# Altium project RF_AMPL_002.PrjPcb
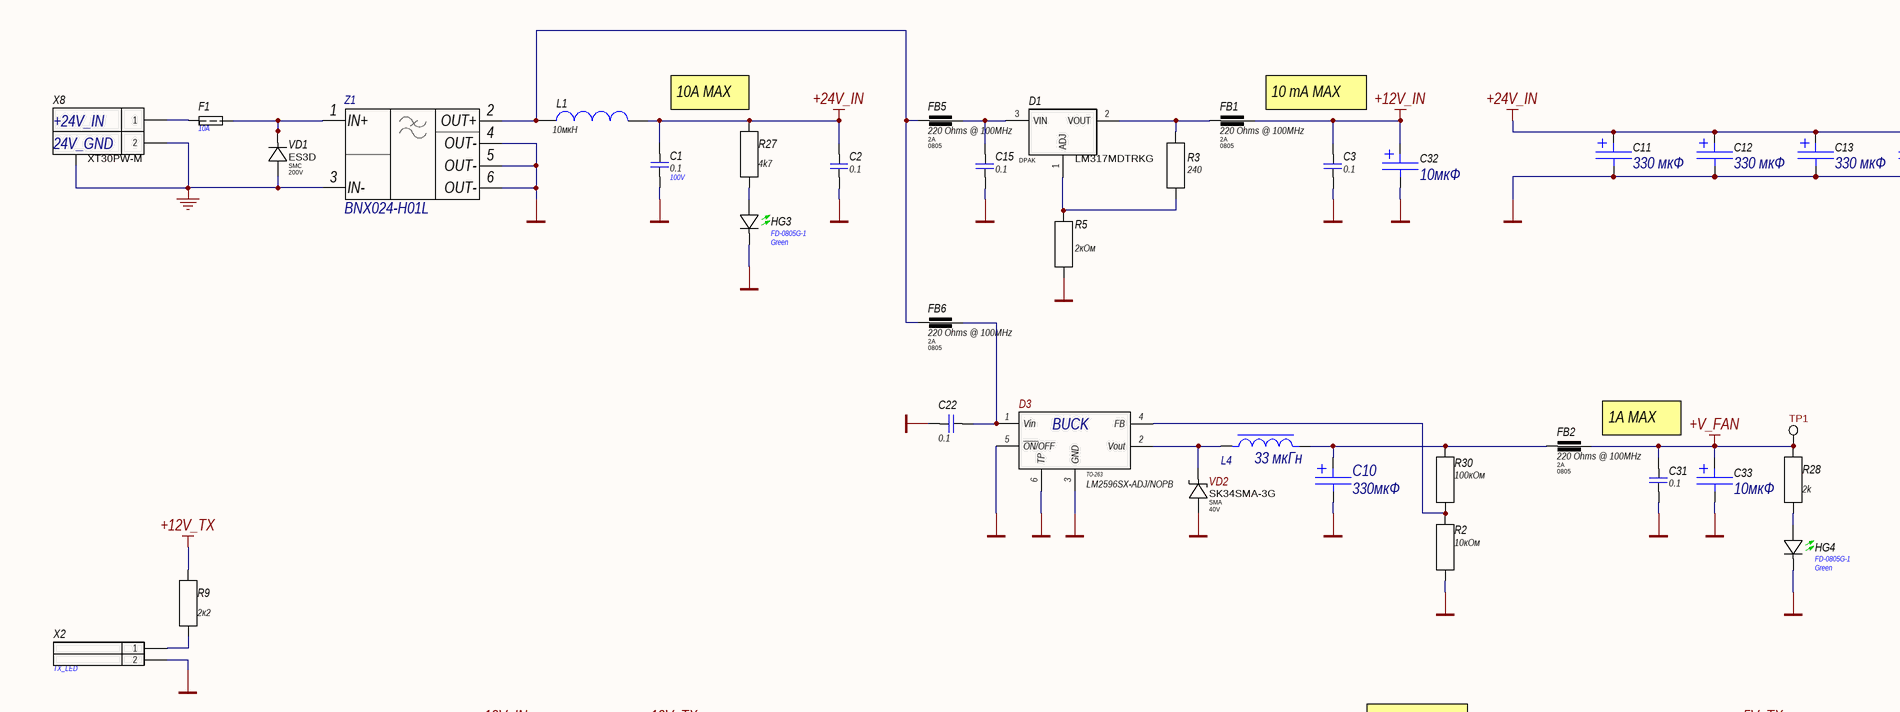
[diagram p0: RF_AMPL_002.SchDoc, top left]
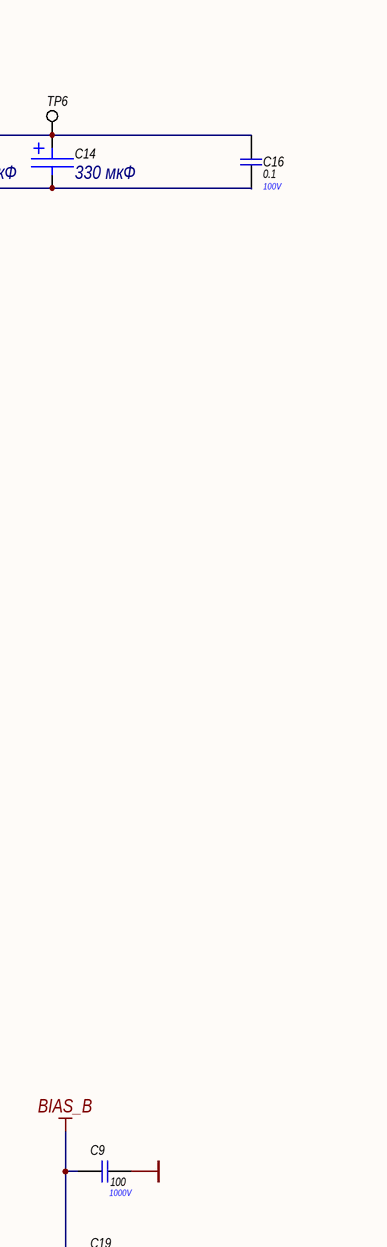
[diagram p1: RF_AMPL_002.SchDoc, top right]
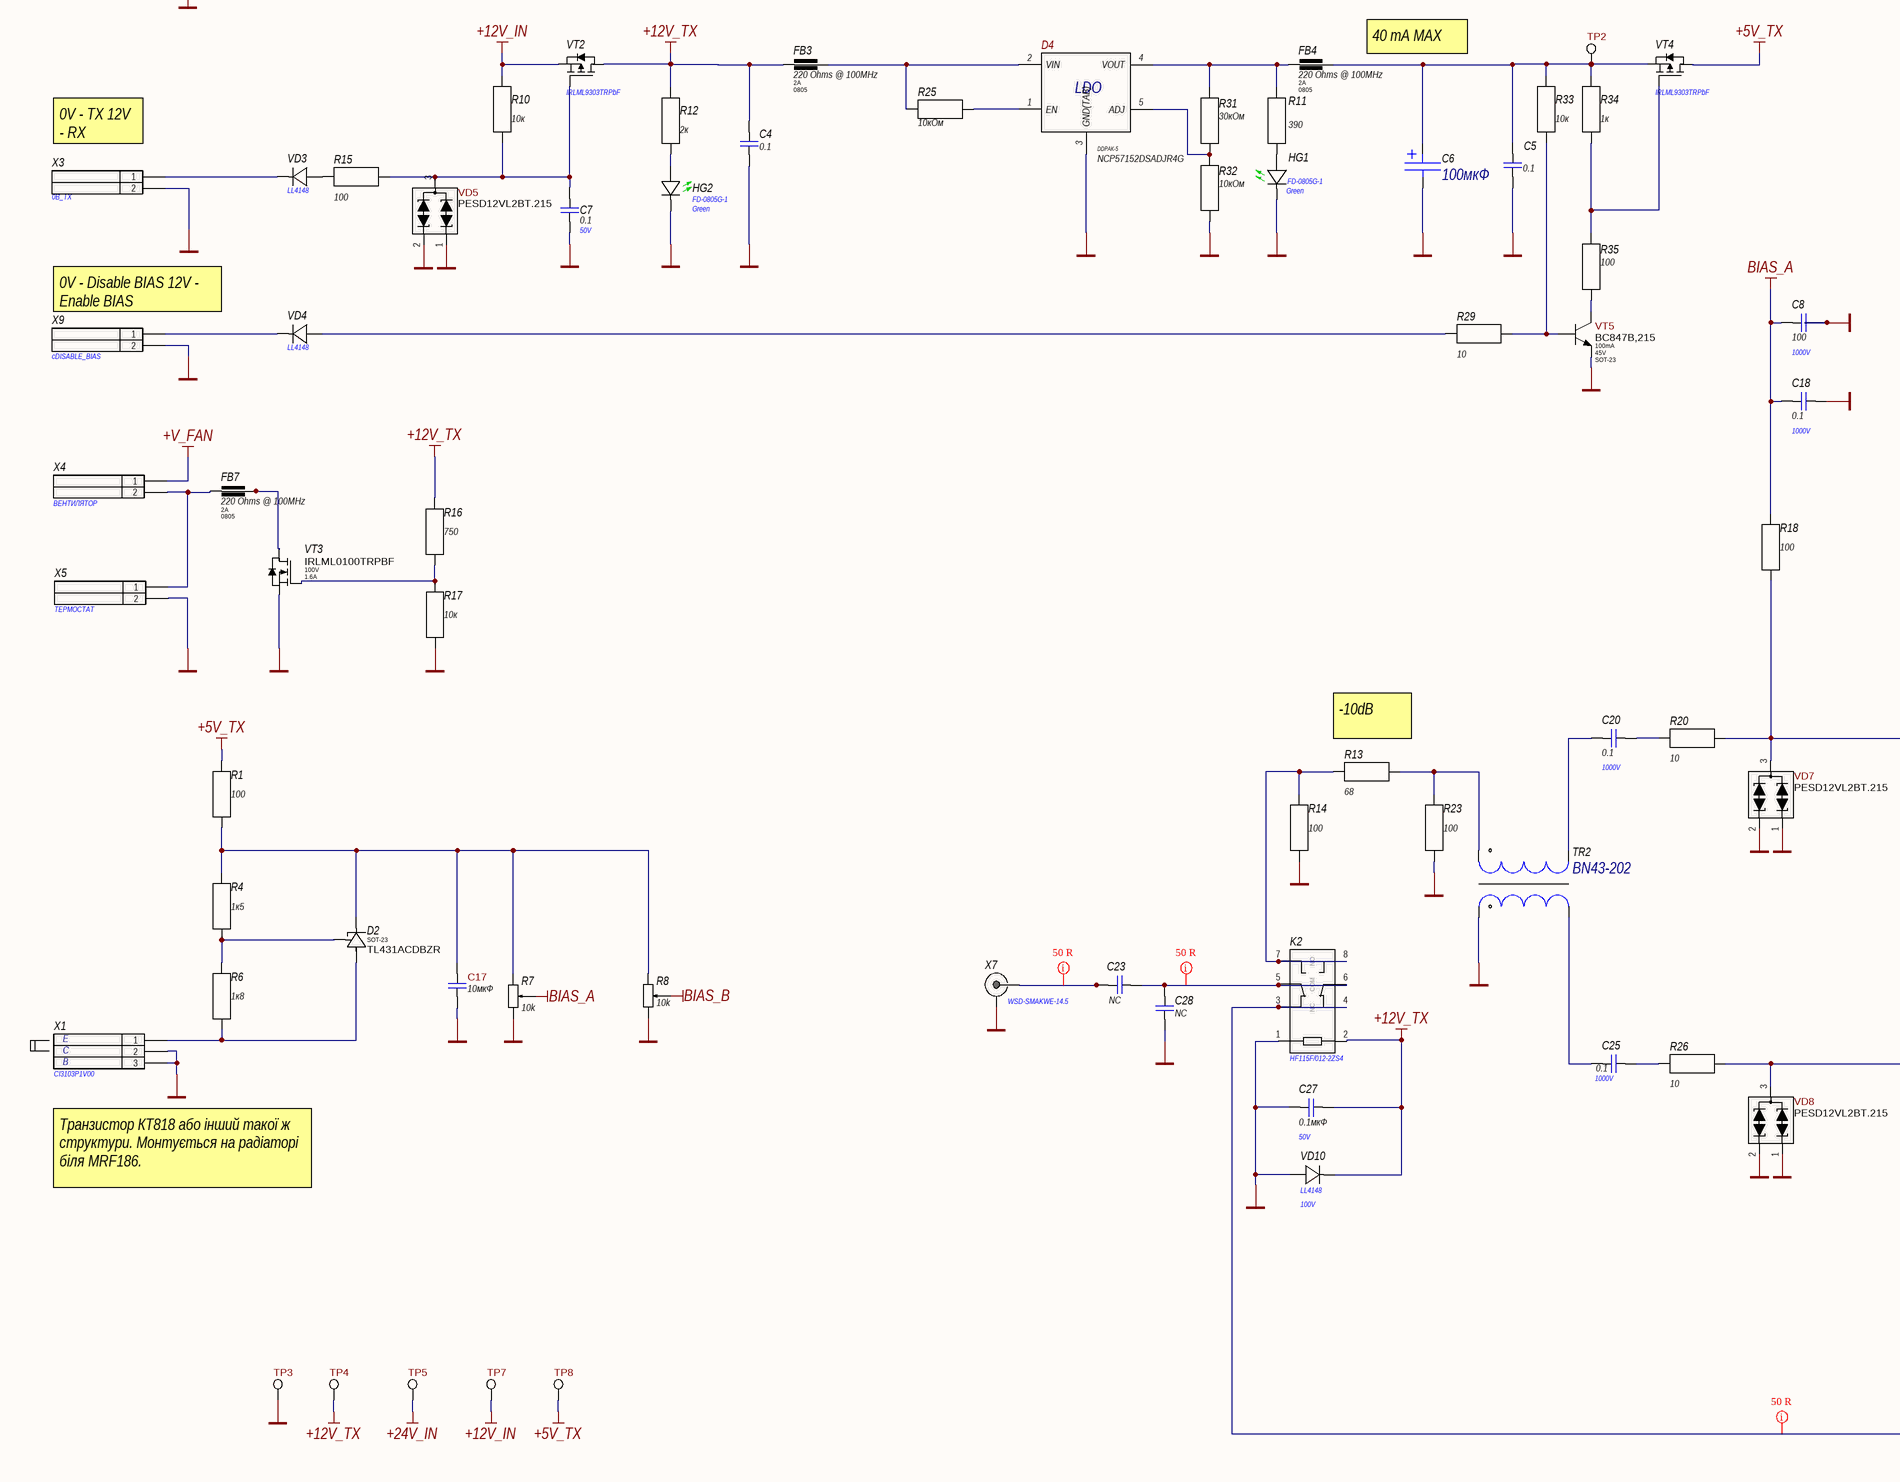
[diagram p2: RF_AMPL_002.SchDoc, bottom left]
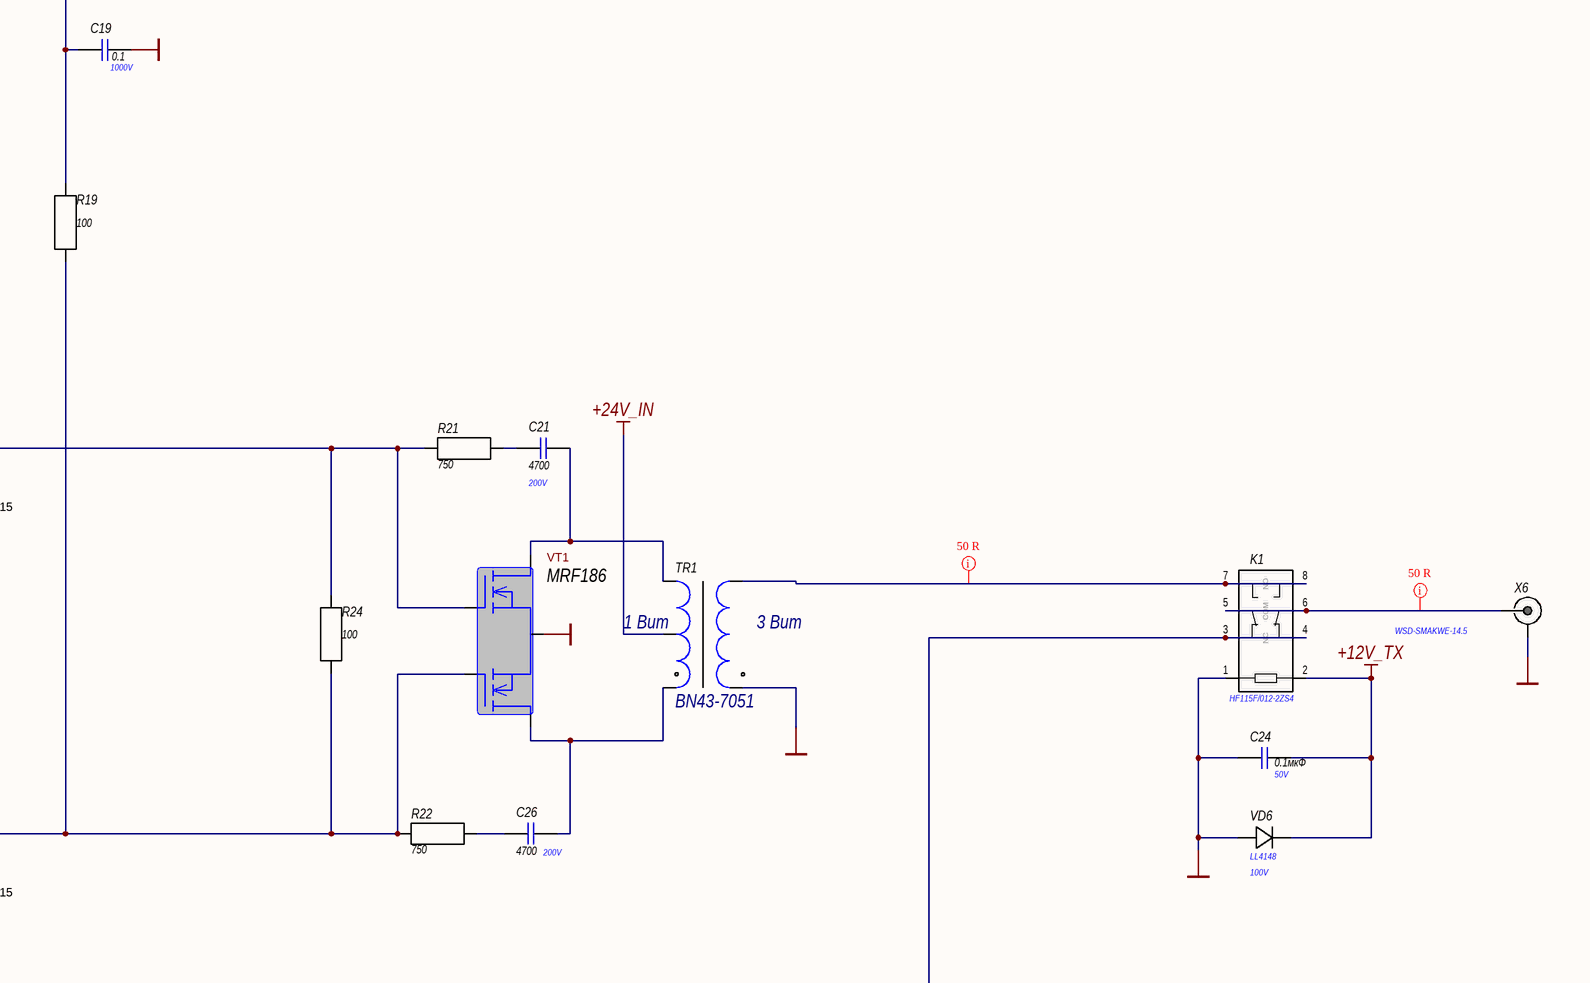
[diagram p3: RF_AMPL_002.SchDoc, bottom right]
1 sheet, 120 parts. Net scope: global (net labels, ports and power ports of the same name join across sheets).
Board file: RF_AMPL_001.PcbDoc

## Sheet RF_AMPL_002.SchDoc: Наименование
size 839 x 594 mm; PageSetup: Record=PageOptions|CenterHorizontal=True|CenterVertical=True|PrintScale=0.94|XCorrection=1.00|YCorrection=1.00|PrintKind=1|BorderSize=5000000|LeftOffset=0|BottomOffset=0|Orientation=1|PaperLength=1000|PaperWidth=1000|Scale=100|PaperSource=7|PrintQuality=-4|MediaType=1|DitherType=10|PaperKind=A4|PrintScaleMode=1; ApprovedBy: Утвердил; CheckedBy: Проверил; Author: Разработал; CompanyName: Организация; SheetNumber: 1; SheetTotal: 1; DecimalNumber: Децимальный номер; HeadOfSector: Нач. сектора; Name1: Наименование1; t_kontr: Т. контр; n_kontr: Н.Контр; lit_A: О; Name2: Наименование2; DocumentName: Sheet1.SCHDOC

### Parts
C1  Voltage: 100V  [C_CERAMIC_1206_MED]  (hidden comment: 0.1)
C2  0.1  [C_CERAMIC_1206_MED]
C3  0.1  [C_CERAMIC_1206_MED]
C4  0.1  [C_CERAMIC_1206_MED]
C5  0.1  [C_CERAMIC_1206_MED]
C6  100мкФ  [CAPM_CASE_D_7.3x4.3x3.1mm]
C7  Voltage: 50V  [C_CERAMIC_1206_MED]  (hidden comment: 0.1)
C8  Voltage: 1000V  [C_CERAMIC_1206_MED]  (hidden comment: 100)
C9  Voltage: 1000V  [C_CERAMIC_1206_MED]  (hidden comment: 100)
C10  330мкФ  [CAPA_CASE_F_Panasonic_FT]
C11  330 мкФ  [CAPA_CASE_G_10.4x10.4x10.5mm]
C12  330 мкФ  [CAPA_CASE_G_10.4x10.4x10.5mm]
C13  330 мкФ  [CAPA_CASE_G_10.4x10.4x10.5mm]
C14  330 мкФ  [CAPA_CASE_G_10.4x10.4x10.5mm]
C15  0.1  [C_CERAMIC_1206_MED]
C16  Voltage: 100V  [C_CERAMIC_1206_MED]  (hidden comment: 0.1)
C17  value 10мкФ  [C_CERAMIC_0805_HI]  (hidden comment: 18pF)
C18  Voltage: 1000V  [C_CERAMIC_1206_MED]  (hidden comment: 0.1)
C19  Voltage: 1000V  [C_CERAMIC_1206_MED]  (hidden comment: 0.1)
C20  Voltage: 1000V  [C_CERAMIC_1206_MED]  (hidden comment: 0.1)
C21  value 4700  Voltage: 200V  [C_CERAMIC_1206_MED]  (hidden comment: 0.1)
C22  0.1  [C_CERAMIC_1206_MED]
C23  NC  [C_CERAMIC_0805_HI]
C24  value 0.1мкФ  Voltage: 50V  [C_CERAMIC_0805_HI]  (hidden comment: 18pF)
C25  Voltage: 1000V  [C_CERAMIC_1206_MED]  (hidden comment: 0.1)
C26  value 4700  Voltage: 200V  [C_CERAMIC_1206_MED]  (hidden comment: 0.1)
C27  value 0.1мкФ  Voltage: 50V  [C_CERAMIC_0805_HI]  (hidden comment: 18pF)
C28  NC  [C_CERAMIC_0805_HI]
C31  0.1  [C_CERAMIC_1206_MED]
C32  10мкФ  [CAPM_CASE_B_3.5x2.8x2.1mm]
C33  10мкФ  [CAPM_CASE_B_3.5x2.8x2.1mm]
D1  LM317MDTRKG  [DPAK]
D2  Package: SOT-23  [SOT-23_MED]  (hidden comment: TL431ACDBZR)
D3  Package: TO-263  [TO-263-5-1]  (hidden comment: LM2596SX-ADJ/NOPB)
D4  NCP57152DSADJR4G  [DDPAK-5]
F1  Current: 10A  [17861640001]  (hidden comment: STANDART_FUSE_HOLDER)
FB1  value 220 Ohms @ 100MHz  Current: 2A  Package: 0805  [BLM21PGxxxxN1-Series]  (hidden comment: BLM21PG221SN1D)
FB2  value 220 Ohms @ 100MHz  Current: 2A  Package: 0805  [BLM21PGxxxxN1-Series]  (hidden comment: BLM21PG221SN1D)
FB3  value 220 Ohms @ 100MHz  Current: 2A  Package: 0805  [BLM21PGxxxxN1-Series]  (hidden comment: BLM21PG221SN1D)
FB4  value 220 Ohms @ 100MHz  Current: 2A  Package: 0805  [BLM21PGxxxxN1-Series]  (hidden comment: BLM21PG221SN1D)
FB5  value 220 Ohms @ 100MHz  Current: 2A  Package: 0805  [BLM21PGxxxxN1-Series]  (hidden comment: BLM21PG221SN1D)
FB6  value 220 Ohms @ 100MHz  Current: 2A  Package: 0805  [BLM21PGxxxxN1-Series]  (hidden comment: BLM21PG221SN1D)
FB7  value 220 Ohms @ 100MHz  Current: 2A  Package: 0805  [BLM21PGxxxxN1-Series]  (hidden comment: BLM21PG221SN1D)
HG1  Part Number: FD-0805G-1  Color: Green  [LTST-C171GKT]  (hidden comment: LTST-C171GKT)
HG2  Part Number: FD-0805G-1  Color: Green  [LTST-C171GKT]  (hidden comment: LTST-C171GKT)
HG3  Part Number: FD-0805G-1  Color: Green  [LTST-C171GKT]  (hidden comment: LTST-C171GKT)
HG4  Part Number: FD-0805G-1  Color: Green  [LTST-C171GKT]  (hidden comment: LTST-C171GKT)
K1  HF115F/012-2ZS4  [HF115Fxxx-1(2)Zx3(4)]
K2  HF115F/012-2ZS4  [HF115Fxxx-1(2)Zx3(4)]
L1  value 10мкH  [IND: R22.9/14/7.62 (H)]
L4  33 мкГн  [INDPWR_Sumida_CDRH127/LD_INDM120120X80N]
R1  100  [R_ANY_CHIP_0805_HI]
R2  10кОм  [R_ANY_CHIP_0805_HI]
R3  240  [R_ANY_CHIP_0805_HI]
R4  1к5  [R_ANY_CHIP_0805_HI]
R5  2кОм  [R_ANY_CHIP_0805_HI]
R6  1к8  [R_ANY_CHIP_0805_HI]
R7  10k  [3296W-1-xxx]
R8  10k  [3296W-1-xxx]
R9  2к2  [R_ANY_CHIP_0805_HI]
R10  10к  [R_ANY_CHIP_0805_HI]
R11  390  [R_ANY_CHIP_0805_HI]
R12  2к  [R_ANY_CHIP_0805_HI]
R13  68  [FKN2WS-Series]
R14  100  [FKN2WS-Series]
R15  100  [R_ANY_CHIP_0805_HI]
R16  750  [R_ANY_CHIP_0805_HI]
R17  10к  [R_ANY_CHIP_0805_HI]
R18  100  [R_ANY_CHIP_0805_HI]
R19  100  [R_ANY_CHIP_0805_HI]
R20  10  [R_ANY_CHIP_0805_HI]
R21  750  [FKN2WS-Series]
R22  750  [FKN2WS-Series]
R23  100  [FKN2WS-Series]
R24  100  [FKN2WS-Series]
R25  10кОм  [R_ANY_CHIP_0805_HI]
R26  10  [R_ANY_CHIP_0805_HI]
R27  4k7  [R_ANY_CHIP_0805_HI]
R28  2k  [R_ANY_CHIP_0805_HI]
R29  10  [R_ANY_CHIP_0805_HI]
R30  100кОм  [R_ANY_CHIP_0805_HI]
R31  30кОм  [R_ANY_CHIP_0805_HI]
R32  10кОм  [R_ANY_CHIP_0805_HI]
R33  10к  [R_ANY_CHIP_0805_HI]
R34  1к  [R_ANY_CHIP_0805_HI]
R35  100  [R_ANY_CHIP_0805_HI]
TP1  PAD-0.96mm  [PAD-0.96mm]  (value not drawn)  (no BOM)
TP2  PAD-0.96mm  [PAD-0.96mm]  (value not drawn)  (no BOM)
TP3  PAD-0.96mm  [PAD-0.96mm]  (value not drawn)  (no BOM)
TP4  PAD-0.96mm  [PAD-0.96mm]  (value not drawn)  (no BOM)
TP5  PAD-0.96mm  [PAD-0.96mm]  (value not drawn)  (no BOM)
TP6  PAD-1.75mm  [PAD-1.75mm]  (value not drawn)  (no BOM)
TP7  PAD-0.96mm  [PAD-0.96mm]  (value not drawn)  (no BOM)
TP8  PAD-0.96mm  [PAD-0.96mm]  (value not drawn)  (no BOM)
TR1  Part Number: BN43-7051  [Amidon_43-7051]  (hidden comment: TR)
TR2  Part Number: BN43-202  [Amidon_43-202]  (hidden comment: TR)
VD1  Voltage: 200V  [SMC]  (hidden comment: ES3D)
VD2  Package: SMA  Voltage: 40V  [SMA_MED]  (hidden comment: SK34SMA-3G)
VD3  LL4148  [SOD-80C_MED]
VD4  LL4148  [SOD-80C_MED]
VD5  PESD12VL2BT.215  [SOT-23_MED]
VD6  Voltage: 100V  [SOD-80C_MED]  (hidden comment: LL4148)
VD7  PESD12VL2BT.215  [SOT-23_MED]
VD8  PESD12VL2BT.215  [SOT-23_MED]
VD10  Voltage: 100V  [SOD-80C_MED]  (hidden comment: LL4148)
VT1  MRF186  [MRF186]
VT2  IRLML9303TRPbF  [SOT-23_MED]
VT3  Vds: 100V  Id: 1.6A  [SOT-23_MED]  (hidden comment: IRLML0100TR)
VT4  IRLML9303TRPbF  [SOT-23_MED]
VT5  Ic: 100mA  Vce: 45V  Package: SOT-23  [SOT-23_MED]  (hidden comment: BC847B)
X1  WH-03S  [WF-3S]  (value not drawn)
X2  Part Number: TX_LED  [WF-2R]  (hidden comment: WH-02R)
X3  Part Number: 0B_TX  [WF-2R]  (hidden comment: WH-02R)
X4  Part Number: ВЕНТИЛЯТОР  [WF-2R]  (hidden comment: WH-02R)
X5  Part Number: ТЕРМОСТАТ  [WF-2R]  (hidden comment: WH-02R)
X6  WSD-SMAKWE-14.5  [KLS1-SMA002]
X7  WSD-SMAKWE-14.5  [KLS1-SMA002]
X8  XT30PW-M  [XT30PW-M]
X9  Part Number: cDISABLE_BIAS  [WF-2R]  (hidden comment: WH-02R)
Z1  Part Number: BNX024-H01L  [Murata_BNX02xH01x]

### Nets
+5V_TX: R1.1 TP8.1 VT4.3(D)
+12V_IN: C3.1 C32.1 FB1.1 R10.2 TP7.1 VT2.2(S)
+12V_TX: C4.1 C24.2 C27.2 FB3.2 K1.2(COIL2) K2.2(COIL2) R9.2 R12.1 R16.1 TP4.1 VD6.CA VD10.CA VT2.3(D)
+24V_IN: C1.2 C2.1 C11.1 C12.1 C13.1 C14.1 C16.1 L1.1 R27.1 TP5.1 TP6.1 TR1.4
+V_FAN: C31.1 C33.1 FB2.1 R28.1 TP1.1 X4.1
BIAS_A: C8.1 C18.1 R7.2(WIPER) R18.1
BIAS_B: C9.1 C19.1 R8.2(WIPER) R19.1
GND: C1.1 C2.2 C3.2 C4.2 C5.2 C6.2 C7.2 C8.2 C9.2 C10.2 C11.2 C12.2 C13.2 C14.2 C15.2 C16.2 C17.2 C18.2 C19.2 C22.2 C24.1 C27.1 C28.2 C31.2 C32.2 C33.2 D3.3(GND) D3.5(~{ON/}OFF) D3.6(TP) D4.3(GND(TAB)) HG1.CA(Cathode) HG2.CA(Cathode) HG3.CA(Cathode) HG4.CA(Cathode) K1.1(COIL1) K2.1(COIL1) R2.2 R5.1 R7.3(CW) R8.3(CW) R14.1 R17.1 R23.1 R32.2 TP3.1 TR1.1 TR2.1 VD2.AN VD5.1 VD5.2 VD6.AN VD7.1 VD7.2 VD8.1 VD8.2 VD10.AN VT1.5(S) VT3.2(S) VT5.2(E) X1.2 X1.3 X2.2 X3.2 X5.2 X6.2 X7.2 X9.2 Z1.4(OUT-) Z1.5(OUT-) Z1.6(OUT-)
GND_IN: VD1.AN X8.2 X8.MP Z1.3(IN-)
NetC5_1: C5.1 C6.1 FB4.1 R33.2 R34.2 TP2.1 VT4.2(S)
NetC7_1: C7.1 R10.1 R15.1 VD5.3 VT2.1(G)
NetC10_1: C10.1 FB2.2 L4.2 R30.1
NetC15_1: C15.1 D1.3(VIN) FB5.1
NetC17_1: C17.1 D2.1(C) R1.2 R4.1 R7.1(CCW) R8.1(CCW)
NetC20_1: C20.1 TR2.4
NetC20_2: C20.2 R20.1
NetC21_1: C21.1 TR1.5 VT1.1(D)
NetC21_2: C21.2 R21.1
NetC22_1: C22.1 D3.1(Vin) FB6.1
NetC23_1: C23.1 C28.1 K2.5(1-COM) K2.6(2-COM)
NetC23_2: C23.2 X7.1
NetC25_1: C25.1 TR2.3
NetC25_2: C25.2 R26.1
NetC26_1: C26.1 TR1.3 VT1.2(S)
NetC26_2: C26.2 R22.1
NetD1_1: D1.1(ADJ) R3.1 R5.2
NetD1_2: D1.2(VOUT) FB1.2 R3.2
NetD2_2: D2.2(REF) R4.2 R6.1
NetD2_3: D2.3(A) R6.2 X1.1
NetD3_2: D3.2(Vout) L4.1 VD2.CA
NetD3_4: D3.4(FB) R2.1 R30.2
NetD4_1: D4.1(EN) R25.2
NetD4_2: D4.2(VIN) FB3.1 R25.1
NetD4_4: D4.4(VOUT) FB4.2 R11.2 R31.1
NetD4_5: D4.5(ADJ) R31.2 R32.1
NetF1_1: F1.1 X8.1
NetF1_2: F1.2 VD1.CA Z1.1(IN+)
NetFB5_2: FB5.2 FB6.2 L1.2 Z1.2(OUT+)
NetFB7_1: FB7.1 VT3.3(D)
NetFB7_2: FB7.2 X4.2 X5.1
NetHG1_AN: HG1.AN(Anode) R11.1
NetHG2_AN: HG2.AN(Anode) R12.2
NetHG3_AN: HG3.AN(Anode) R27.2
NetHG4_AN: HG4.AN(Anode) R28.2
NetK1_3: K1.3(1-NC) K1.4(2-NC) K2.3(1-NC) K2.4(2-NC)
NetK1_5: K1.5(1-COM) K1.6(2-COM) X6.1
NetK1_7: K1.7(2-NO) K1.8(2-NO) TR1.2
NetK2_7: K2.7(2-NO) K2.8(2-NO) R13.1 R14.2
NetR9_1: R9.1 X2.1
NetR13_2: R13.2 R23.2 TR2.2
NetR15_2: R15.2 VD3.AN
NetR16_2: R16.2 R17.2 VT3.1(G)
NetR18_2: R18.2 R20.2 R21.2 R24.2 VD7.3 VT1.3(G)
NetR19_2: R19.2 R22.2 R24.1 R26.2 VD8.3 VT1.4(G)
NetR29_1: R29.1 R33.1 VT5.1(B)
NetR29_2: R29.2 VD4.AN
NetR34_1: R34.1 R35.1 VT4.1(G)
NetR35_2: R35.2 VT5.3(C)
NetVD3_CA: VD3.CA X3.1
NetVD4_CA: VD4.CA X9.1

### Layout directives
net class CPW: NetC23_1, NetC23_2, NetK1_3, NetK1_5, NetK1_7

### Notes on the sheet
- (near X8) +24V_IN
- (near X8) 24V_GND
- (near R27) 10A MAX
- (near FB1) 10 mA MAX
- 1A MAX
- 40 mA MAX
- (near X3) 0V - TX 12V - RX
- (near X9) 0V - Disable BIAS 12V - Enable BIAS
- (near R13) -10dB
- (near TR1) 1 Вит
- (near TR1) 3 Вит
- E
- C
- B
- (near X1) Транзистор КТ818 або інший такої ж структури. Монтується на радіаторі біля MRF186.
- Перв.примен.
- Справ.№
- Подп. и дата
- Инв.№ дубл.
- Взам.инв.№
- Подп.и дата
- Разраб.
- Изм.
- Лист
- № докум.
- Подп.
- Дата
- Лит.
- Масштаб
- Масса
- Т.контр.
- Пров.
- СХЕМА   ЭЛЕКТРИЧЕСКАЯ
- ПРИНЦИПИАЛЬНАЯ
- Листов
- Инв.№ подл.
- Утв.
- Н.контр.
- Нач.сект.
- Формат  A1
- (in symbol HF115F/012-2ZS4) NO; COM; NC
- (in symbol LM2596SX-ADJ/NOPB) BUCK
- (in symbol NCP57152DSADJR4G) LDO

### Library data of the parts
C1 C7-C9 C16 C18-C20 C25 = 1206B102K102CG: 1nF 1000V X7R ±10% 1206 Ceramic Capacitor RoHS; Manufacturer: Walsin; Standard Lead Time: 31 Weeks; Component Status: Released; Replacement: NONE; Package: 1206; Dielectric Type: X7R; Part Number: 1206B102K102CG; Part Type: Ceramic / X7R / 1206; Component Type: SMD; Temperature Range: -55°C ~ 125°C; Tolerance: ±10%; ComponentLink1URL: https://eu.mouser.com/datasheet/2/210/Middle_and_High_Voltage_DS-1535659.pdf; Supplier 1: Mouser; Supplier Part Number 1: 791-1206B102K102CT; Price: 0; ComponentLink1Description: Datasheet
  C1 C7 C16 C18-C20 C25: Value: 0.1
  C8 C9: Value: 100
C2-C5 C15 C22 C31 = 1206B102K102CG: 1nF 1000V X7R ±10% 1206 Ceramic Capacitor RoHS; Manufacturer: Walsin; Voltage: 100V; Standard Lead Time: 31 Weeks; Component Status: Released; Replacement: NONE; Value: 0.1; Package: 1206; Dielectric Type: X7R; Part Number: 1206B102K102CG; Part Type: Ceramic / X7R / 1206; Component Type: SMD; Temperature Range: -55°C ~ 125°C; Tolerance: ±10%; ComponentLink1URL: https://eu.mouser.com/datasheet/2/210/Middle_and_High_Voltage_DS-1535659.pdf; Supplier 1: Mouser; Supplier Part Number 1: 791-1206B102K102CT; Price: 0; ComponentLink1Description: Datasheet
C6 = CAP_TANTALUM_POLAR_CASE_D: Capacitor Tantalum *pF ±*% *V Case D; Manufacturer: AVX; Part Number: TAJD107M016R; Voltage: 16В; Type: Конденсатор танталовий; Dielectric: X7R; Name: 100мкФ ±*% 16В X7R Case D TAJD107M016R [AVX]; Package: Case D; Value: 100мкФ; Tolerance: ±*%; Mount: SMT; Min Operating Temperature: -55°C; Max Operating Temperature: +125°C; ComponentLink1Description1: *; ComponentLink1Description: Datasheet Link; ComponentLink1Description: New link; Number of Pins: 2; Component Function: *
C10 = CAP_ELECTROLYTIC_POLAR_CASE_F_Panasonic_FT: Capacitor Electrolytic *pF ±*% *V Case F; Part Number: EEEFK1C331P; Voltage: 16В; Type: Конденсатор електролітичний поляризований; Manufacturer: Panasonic; Package: Case F; Value: 330мкФ; Tolerance: ±*%; Mount: SMT; Min Operating Temperature: -55°C; Max Operating Temperature: +105°C; ComponentLink1Description1: *; ComponentLink1Description: Datasheet Link; ComponentLink1Description: New link; Number of Pins: 2; Name: =Value+' '+Tolerance+' '+Voltage+' '+Dielectric+' '+Package+' '+"Part Number"+' ['+"Manufacturer"+']'; Component Function: *
C11-C14 = CAP_ELECTROLYTIC_POLAR_CASE_G: Capacitor Electrolytic *pF ±*% *V Case G; Voltage: *В; Type: Конденсатор електролітичний поляризований; Manufacturer: *; Part Number: *; Package: Case G; Value: 330 мкФ; Tolerance: ±*%; Mount: SMT; Min Operating Temperature: -55°C; Max Operating Temperature: +125°C; ComponentLink1Description1: *; ComponentLink1Description: Datasheet Link; ComponentLink1Description: New link; Number of Pins: 2; Name: =Value+' '+Tolerance+' '+Voltage+' '+Dielectric+' '+Package+' '+"Part Number"+' ['+"Manufacturer"+']'; Component Function: *
C17 = CERAMIC_0805: Part Number: **; Manufacturer: Hitano; Voltage: 50V; Dielectric Type: C0G/NP0; Component Status: Released; Tolerance: ±5%; Replacement: NONE; GUID_1C: 32087c8a-96b8-11ea-ab61-0050569f2651; Package: 0805; Part Type: Ceramic / C0G(NP0) / 0402; Component Type: SMD; Temperature Range: -55°C ~ 125°C; ComponentLink1URL: \\altiumdb.ajax.local\files\Datasheet\Capacitor\Hitano-MLCC.pdf; Price: 0; ComponentLink1Description: Datasheet
C21 C26 = 1206B102K102CG: 1nF 1000V X7R ±10% 1206 Ceramic Capacitor RoHS; Part Number: 12065A472JAT2A; Manufacturer: Walsin; Standard Lead Time: 31 Weeks; Component Status: Released; Replacement: NONE; Package: 1206; Dielectric Type: X7R; Part Type: Ceramic / X7R / 1206; Component Type: SMD; Temperature Range: -55°C ~ 125°C; Tolerance: ±10%; ComponentLink1URL: https://eu.mouser.com/datasheet/2/210/Middle_and_High_Voltage_DS-1535659.pdf; Supplier 1: Mouser; Supplier Part Number 1: 791-1206B102K102CT; Price: 0; ComponentLink1Description: Datasheet
C23 C28 = CERAMIC_0805: Part Number: **; Manufacturer: Hitano; Component Status: Released; Tolerance: ±5%; Replacement: NONE; GUID_1C: 32087c8a-96b8-11ea-ab61-0050569f2651; Voltage: 50V; Dielectric Type: C0G/NP0; Part Type: Ceramic / C0G(NP0) / 0402; Component Type: SMD; Temperature Range: -55°C ~ 125°C; ComponentLink1URL: \\altiumdb.ajax.local\files\Datasheet\Capacitor\Hitano-MLCC.pdf; Price: 0; ComponentLink1Description: Datasheet; Value: NC; Package: 0805
C24 C27 = CERAMIC_0805: Part Number: **; Manufacturer: Hitano; Component Status: Released; Tolerance: ±5%; Replacement: NONE; GUID_1C: 32087c8a-96b8-11ea-ab61-0050569f2651; Dielectric Type: C0G/NP0; Part Type: Ceramic / C0G(NP0) / 0402; Component Type: SMD; Temperature Range: -55°C ~ 125°C; ComponentLink1URL: \\altiumdb.ajax.local\files\Datasheet\Capacitor\Hitano-MLCC.pdf; Price: 0; ComponentLink1Description: Datasheet; Package: 0805
C32 C33 = CAP_TANTALUM_POLAR_CASE_B: Capacitor Tantalum *pF ±*% *V Case B; Voltage: 20; Type: Конденсатор танталовий; Dielectric: X7R; Name: 10мкФ ±*% 20 X7R Case B * [*]; Manufacturer: *; Part Number: *; Package: Case B; Value: 10мкФ; Tolerance: ±*%; Mount: SMT; Min Operating Temperature: -55°C; Max Operating Temperature: +125°C; ComponentLink1Description1: *; ComponentLink1Description: Datasheet Link; ComponentLink1Description: New link; Number of Pins: 2; Component Function: *
D1 = LM317MDTRKG: 4.25V to 40V Input Linear Voltage Regulator, 1 Output 500mA, Adjustable, TO-252-3 (DPAK); Manufacturer: Onsemi; Standard Lead Time: 11 Weeks; Component Status: Review; Replacement: NONE; Part Type: Power / Linear Regulator; Component Type: SMD; Temperature Range: 0°C ~ 125°C; ComponentLink1URL: https://eu.mouser.com/datasheet/2/308/LM317M_D-1810713.pdf; Supplier 1: Digi-Key; Supplier Part Number 1: LM317MDTRKGOSTR-ND; Price: NONE; ComponentLink1Description: Datasheet; Package: DPAK; Part Number: LM317MDTRKG
D2 = TL431ACDBZR: Adjustable Precision Shunt Regulator, Accuracy 1%,  SOT-23-3; Manufacturer: Texas Instruments; Standard Lead Time: 8 Weeks; Component Status: Released; Replacement: NONE; Part Number: TL431ACDBZR; Part Type: Voltage Reference; Component Type: SMD; Temperature Range: 0°C ~ 70°C; ComponentLink1URL: https://www.ti.com/lit/ds/symlink/tl431.pdf; Supplier 1: Digi-Key; Supplier Part Number 1: 296-17328-1-ND; Price: 0.046; ComponentLink1Description: Datasheet
D3 = LM2596SX-ADJ/NOPB: SIMPLE SWITCHER Power Converter 150-kHz 3-A Step-Down Voltage Regulator; Manufacturer: Texas Instruments; Standard Lead Time: 6 Weeks; Component Status: Review; Replacement: NONE; Part Type: Power / DC-DC / Buck; Component Type: SMD; Temperature Range: -40°C ~ 125°C; ComponentLink1URL: http://www.ti.com/lit/ds/symlink/lm2596.pdf; Supplier 1: Mouser; Supplier Part Number 1: 926-LM2596SX-ADJNOPB; Price: NONE; ComponentLink1Description: Datasheet; Part Number: LM2596SX-ADJ/NOPB
D4 = NCP57152DSADJR4G: 1.24V to 13V Input Low Dropout Regulator, Adjustable, 1.5A, D2PAK-5; Manufacturer: Onsemi; Standard Lead Time: 7 Weeks; Component Status: Released; Replacement: NONE; Package: DDPAK-5; Part Number: NCP57152DSADJR4G; Part Type: Power / Linear Regulator; Component Type: SMD; Temperature Range: -40°C ~ 125°C; ComponentLink1URL: https://eu.mouser.com/datasheet/2/308/1/NCP57152_D-2317407.pdf; Supplier 1: Mouser; Supplier Part Number 1: 863-NCP57152DSADJR4G; Price: 1.476; ComponentLink1Description: Datasheet
F1 = STANDART_FUSE_HOLDER: Automotive Fuse holder THT-Mount; Manufacturer_Name: LITTELFUSE; Datasheet Link: https://www.littelfuse.com/media?resourcetype=2d-prints&itemid=dcb90cf3-0771-4ccd-8726-26101cf00574&filename=ol-178.6164.0000(c); Height: 17.5mm; Manufacturer_Part_Number: 17861640001
FB1-FB7 = BLM21PG221SN1D: 220 Ohms @ 100MHz Power Line Ferrite Bead 0805, 2A 45mOhm; Manufacturer: Murata Electronics; Saturation Current: NONE; Tolerance: ±25%; Component Status: Released; Standard Lead Time: 8 Weeks; Part Number: BLM21PG221SN1D; Part Type: Ferrite Bead; Component Type: SMD; Temperature Range: -55°C ~ 125°C; ComponentLink1URL: https://www.murata.com/en-us/products/productdata/8796738977822/ENFA0005.pdf; Supplier 1: Digi-Key; Supplier Part Number 1: 490-1054-2-ND; Replacement: NONE; Price: 0.00864; ComponentLink1Description: Datasheet
HG1-HG4 = LTST-C171GKT: Low Power LED, Green 565nm, Clear, SMD 0805, Vf 2.1V - 2.6V, 5 ~ 12mcd @ 20 mA, 130°; Manufacturer: Lite-On Optoelectronics; Component Status: Released; Replacement: NONE; GUID_1C: df39881f-c399-11eb-ab74-0050569f2651; Part Type: LED / 0805; Component Type: SMD; Package: 0805; Wavelength: 565nm; Temperature Range: -55°C ~ 85°C; Supplier 1: Digi-Key; Supplier Part Number 1: 160-1423-2-ND; Price: 0.06; ComponentLink1Description: Datasheet
K1 K2 = HF115F/012-2ZS4: Miniature High Power Relay, DPDT (2 Form C), 12VDC 400mW Coil, 5.0mm 2 Pole 8A AgCdO; Manufacturer: Hongfa; Ajax_1C_ID: 38428; Ajax_1C_PN: HF115F/012-2ZS4 HONGFA, Реле; Ajax_1С_Status: RND Only; Component Status: Released; Replacement: NONE; GUID_1C: 4ba44618-64be-11ec-a90c-00505699469b; Part Number: HF115F/012-2ZS4; Part Type: Relay; Component Type: PTH; Temperature Range: -40°C ~ 85°C; ComponentLink1URL: https://www.tme.eu/Document/2962d862af219292e2e76bbc4b5ef3a2/hf115f.pdf; Supplier 1: TME; Supplier Part Number 1: HF115F/012-2ZS4; Price: 2.27649268; ComponentLink1Description: Datasheet
L1 = Inductor_R22.9/14/7.62: Manufacturer: Magnetics; PartNumber: 0077310A7; ValueManufacturerPartNumber: Fixed inductor, 10мкH, ±20%, R22.9/14/7.62, Kool Mu, µ=125, 90 нГн/витков2; TypeInductor: Fixed inductor; TypeMatiriel: Kool Mu; AL: 90 нГн/витков2; MaterialPermeability: µ=125; Tolerance: ±20%; Package: R22.9/14/7.62; HelpURL: http://ferrite.ru/warehouse/r-22-9147-62-77310-a7.html
L4 = INDPWR_Sumida_CDRH127/LD: FIXED IND  UH   A  MOHM SMD; Manufacturer: Sumida; Type: Котушка індуктивності; Name: 33 мкГн ±*% A 0.472" L x 0.472" W (12.00mm x 12.00mm) CDRH127/LD [Sumida]; DC Resistance (DCR) (Max): мОм; Tolerance: ±*%; Part Number: CDRH127/LD; Package: 0.472" L x 0.472" W (12.00mm x 12.00mm); Value: 33 мкГн; Current Rating (Max): A; Mount: SMT; Min Operating Temperature: -40°C; Max Operating Temperature: +110°C; ComponentLink1Description1: *; ComponentLink1Description: Datasheet Link; ComponentLink1Description: New link; Number of Pins: 2; Component Function: *
R1-R6 R9-R12 R15-R20 R25-R29 R31-R35 = RES_0805: RES 0.47 OHM 1% 1/8W 0805; Manufacturer: Panasonic Electronic Components; Part Number: ERJ-3RQFR47V; Voltage: 50V; Component Type: SMD; Package: 0402; Tolerance: 1%
  R1 R15 R18 R19 R35: Value: 100
  R2 R25 R32: Value: 10кОм
  R3: Value: 240
  R4: Value: 1к5
  R5: Value: 2кОм
  R6: Value: 1к8
  R9: Value: 2к2
  R10 R17 R33: Value: 10к
  R11: Value: 390
  R12: Value: 2к
  R16: Value: 750
  R20 R26 R29: Value: 10
  R27: Value: 4k7
  R28: Value: 2k
  R31: Value: 30кОм
  R34: Value: 1к
R7 R8 = 3296W-1-103LF: 10 kOhms ±10% Trimmer Resistor, 0.5W, Through Hole 3/8", 4.83x9.53mm, 10.03mm Height; Manufacturer: Bourns; Ajax_1C_PN: NONE; Ajax_1С_Status: RND Only; Component Status: On Review; Temperature Stability: ±100ppm/°C; Tolerance: ±10%; Package: 4.83x9.53mm; Value: 10k; Part Number: 3296W-1-103LF; Component Type: PTH; Part Type: Trimming Potentiometer; Power Rating: 0.5W; Temperature Range: -55°C ~ 125°C; ComponentLink1URL: https://www.bourns.com/data/global/pdfs/3296.pdf; Supplier 1: Mouser; Supplier Part Number 1: 652-3296W-1-103LF; Replacement: NONE; Price: NONE; ComponentLink1Description: Datasheet
R13 R14 R21-R24 = RES_THT: RESISTORS THT; Manufacturer: Panasonic Electronic Components; Part Number: ERJ-3RQFR47V; Voltage: 50V; Tolerance: 1%; Component Type: SMD; Package: THT
  R13: Value: 68
  R14 R23 R24: Value: 100
  R21 R22: Value: 750
R30 = RES_0805: 100кОм 1% 1/8W 0805; Manufacturer: Panasonic Electronic Components; Part Number: ERJ-3RQFR47V; Voltage: 50V; Component Type: SMD; Package: 0402; Tolerance: 1%; Value: 100кОм
TP1-TP5 TP7 TP8 = PAD-0.96mm: 0.96mm Pad for Plug-In or Receptacle; Ajax_1C_PN: NONE; Ajax_1С_Status: RND Only; Component Status: Released; Part Number: PAD-0.96mm; Component Type: PTH; Manufacturer: NONE; Part Type: Pad; Temperature Range: NONE; ComponentLink1URL: NONE; Replacement: NONE; Price: NONE; ComponentLink1Description: Datasheet
TP6 = PAD-1.75mm: 1.75mm Pad for Plug-In or Receptacle; Ajax_1C_PN: NONE; Ajax_1С_Status: RND Only; Component Status: Released; Part Number: PAD-1.75mm; Component Type: PTH; Manufacturer: NONE; Part Type: Pad; Temperature Range: NONE; ComponentLink1URL: NONE; Replacement: NONE; Price: NONE; ComponentLink1Description: Datasheet
TR1 = Amidon_BN43-7051: Manufacturer: Handmade; Saturation Current: 11.3A; Tolerance: ±20%; ComponentLink1Description: Datasheet; ComponentLink1URL: https://www.vishay.com/docs/34193/ihlp-4040dz-01.pdf
TR2 = Amidon_BN43-202: Manufacturer: Handmade; Saturation Current: 11.3A; Tolerance: ±20%; ComponentLink1Description: Datasheet; ComponentLink1URL: https://www.vishay.com/docs/34193/ihlp-4040dz-01.pdf
VD1 = ES3D: Diode Standard 200V 3A, SMC; Manufacturer: Onsemi; Component Status: Released; Standard Lead Time: 10 Weeks; Vf: 0.95V @ 3A; Replacement: NONE; Part Number: ES3D; Package: SMC; Part Type: General; Component Type: SMD; Marking: ES3D; Current: 3A; Temperature Range: -50°C ~ 150°C; Supplier 1: Digi-Key; Supplier Part Number 1: ES3DFSTR-ND; Price: 0.15; ComponentLink1Description: Datasheet
VD2 = SK34SMA-3G: Diode Schottky 40V 3A, SMA, Leakage Current 50uA; Manufacturer: Diodec Semiconductor; Component Status: Released; Standard Lead Time: 17 Weeks; Vf: 0.5V @ 3A; Replacement: NONE; Part Number: SK34SMA-3G; Part Type: Schottky; Component Type: SMD; Current: 3A; Temperature Range: -50°C ~ 150°C; Supplier 1: Mouser; Supplier Part Number 1: 637-SK34SMA-3G; Price: 0.6; ComponentLink1Description: Datasheet
VD3 VD4 VD6 VD10 = LL4148: Fast Switching Diode, 100V 200 mA, SOD-80C; Manufacturer: Suntan; Marking: NONE; Component Status: Released; Current: 200mA; Vf: 1V @ 10mA; Part Number: LL4148; Package: SOD-80; Part Type: Fast Switching; Component Type: SMD; Standard Lead Time: NONE; Temperature Range: -65°C ~ 175°C; Replacement: NONE; Price: 0.02625203; ComponentLink1Description: Datasheet
  VD3 VD4: Voltage: 100V
VD5 VD7 VD8 = PESD3V3L2BT,215: Double Bidirectional TVS Diode 26V Clamp, 15A (8/20us) Ipp, SOT-23; Manufacturer: Nexperia USA; Marking: V3*; Component Status: Released; Standard Lead Time: 8 Weeks; Voltage: 12V; Replacement: NONE; Part Number: PESD12VL2BT.215; Part Type: TVS / ESD Protection; Component Type: SMD; Package: SOT-23; Current: 15A; Temperature Range: -65°C ~ 150°C; Supplier 1: Mouser; Supplier Part Number 1: 771-PESD3V3L4UW115; Price: 0.05203594; ComponentLink1Description: Datasheet
VT1 = MRF186: 40V, 60A max N-Channel AlphaSGT Power MOSFET, 6.1mOhm @ Vgs = 10V; Manufacturer: MOTOROLLA; Component Status: Released; Standard Lead Time: 16 Weeks; Replacement: NONE; Part Type: N-Channel; Component Type: SMD; Temperature Range: -55°C ~ 150°C; ComponentLink1URL: https://aosmd.com/res/data_sheets/AOD66406.pdf; Supplier 1: Digi-Key; Supplier Part Number 1: 785-AOD66406TR-ND; Price: 0.14350545; ComponentLink1Description: Datasheet; Part Number: MRF186
VT2 VT4 = IRLML9301TRPbF: -30V, -3.6A max P-Channel HEXFET MOSFET, 82mOhm @ Vgs = -4.5V; Manufacturer: Infineon Technologies; Component Status: Released; Standard Lead Time: 77 Weeks; Replacement: NONE; Vds: 30V; Id: 3.6A; Rds: 103mOhm; Part Type: P-Channel; Component Type: SMD; Temperature Range: -55°C ~ 150°C; ComponentLink1URL: https://eu.mouser.com/datasheet/2/196/Infineon_IRLML9301_DataSheet_v01_01_EN-1732998.pdf; Supplier 1: Mouser; Supplier Part Number 1: IRLML9301TRPbF; Price: 0.05229076; ComponentLink1Description: Datasheet; Part Number: IRLML9301TRPbF; Package: SOT-23
VT3 = IRLML0100TRPBF: 100V, 1.6A max N-Channel HEXFET Power MOSFET, 190mOhm @ Vgs = 4.5V; Manufacturer: Infineon Technologies; Rds: 220mOhm; Component Status: Released; Standard Lead Time: 13 Weeks; Replacement: NONE; Part Number: IRLML0100TRPBF; Package: SOT-23; Part Type: N-Channel; Component Type: SMD; Temperature Range: -55°C ~ 150°C; ComponentLink1URL: https://www.infineon.com/dgdl/irlml0100pbf.pdf?fileId=5546d462533600a4015356649d9225e8; Supplier 1: Digi-Key; Supplier Part Number 1: IRLML0100TRPBFTR-ND; Price: 0.071; ComponentLink1Description: Datasheet
VT5 = BC847B,215: 45V, 100mA NPN General Purpose Transistor; Manufacturer: Nexperia USA; Component Status: Released; Standard Lead Time: 4 Weeks; Replacement: NONE; Part Number: BC847B,215; Part Type: NPN; Component Type: SMD; Temperature Range: -65°C ~ 150°C; ComponentLink1URL: https://assets.nexperia.com/documents/data-sheet/BC847_SER.pdf; Supplier 1: Digi-Key; Supplier Part Number 1: 1727-2921-2-ND; Price: 0.069; ComponentLink1Description: Datasheet
X1 = CI3103P1V00: WH Series 2.54mm Wire to Board Straight DIP Type Headers, 3 Pin; Manufacturer: CviLux; Replacement: NONE; Part Number: CI3103P1V00; Part Type: Wire-to-Board / Header; Component Type: PTH; Temperature Range: -25℃ ~ 85℃; Price: 0.04922256; ComponentLink1Description: Datasheet
X2-X5 X9 = CI3102P1H00: WH Series 2.54mm Wire to Board Right Angle DIP Type Headers, 2 Pin; Manufacturer: CviLux; Replacement: NONE; Part Type: Wire-to-Board / Header; Component Type: PTH; Temperature Range: -25℃ ~ 85℃; Price: 0.017; ComponentLink1Description: Datasheet
X6 X7 = WSD-SMAKWE-14.5: 50Ohm SMA Connector, Right Angle, Female, 5.1mm; Manufacturer: Wangshen Development LLC; Replacement: NONE; Part Number: WSD-SMAKWE-14.5; Part Type: RF Connector; Component Type: PTH; Temperature Range: -55°C ~ 155°C; Price: NONE; ComponentLink1Description: Datasheet
X8 = XT30PW-M: 2 Pin DC Power Socket, XT30, Male, THT, Right Angle, Yellow, 15A, 500V; Manufacturer: Amass; Replacement: NONE; Part Number: XT30PW-M; Part Type: Power Socket; Component Type: PTH; Temperature Range: -20°C ~ 120°C; Supplier 1: TME; Supplier Part Number 1: XT30PW-M; Price: 0.37753379; ComponentLink1Description: Datasheet
Z1 = BNX024H01L: LC EMI Filter 5th Order Low Pass 2 Channel C = 4.7µF 20 A 6-SMD [12.1x9.1]; Manufacturer: Murata; Name: BNX024-H01L [Murata]; Package: 6-SMD [12.1x9.1]; Type: Фільтр силовий; Mount: SMT; Min Operating Temperature: -55°C; Max Operating Temperature: +125°C; ComponentLink1Description1: *; ComponentLink1Description: New link; Number of Pins: 6; Component Function: *